# Altium project turret1.PrjPCB
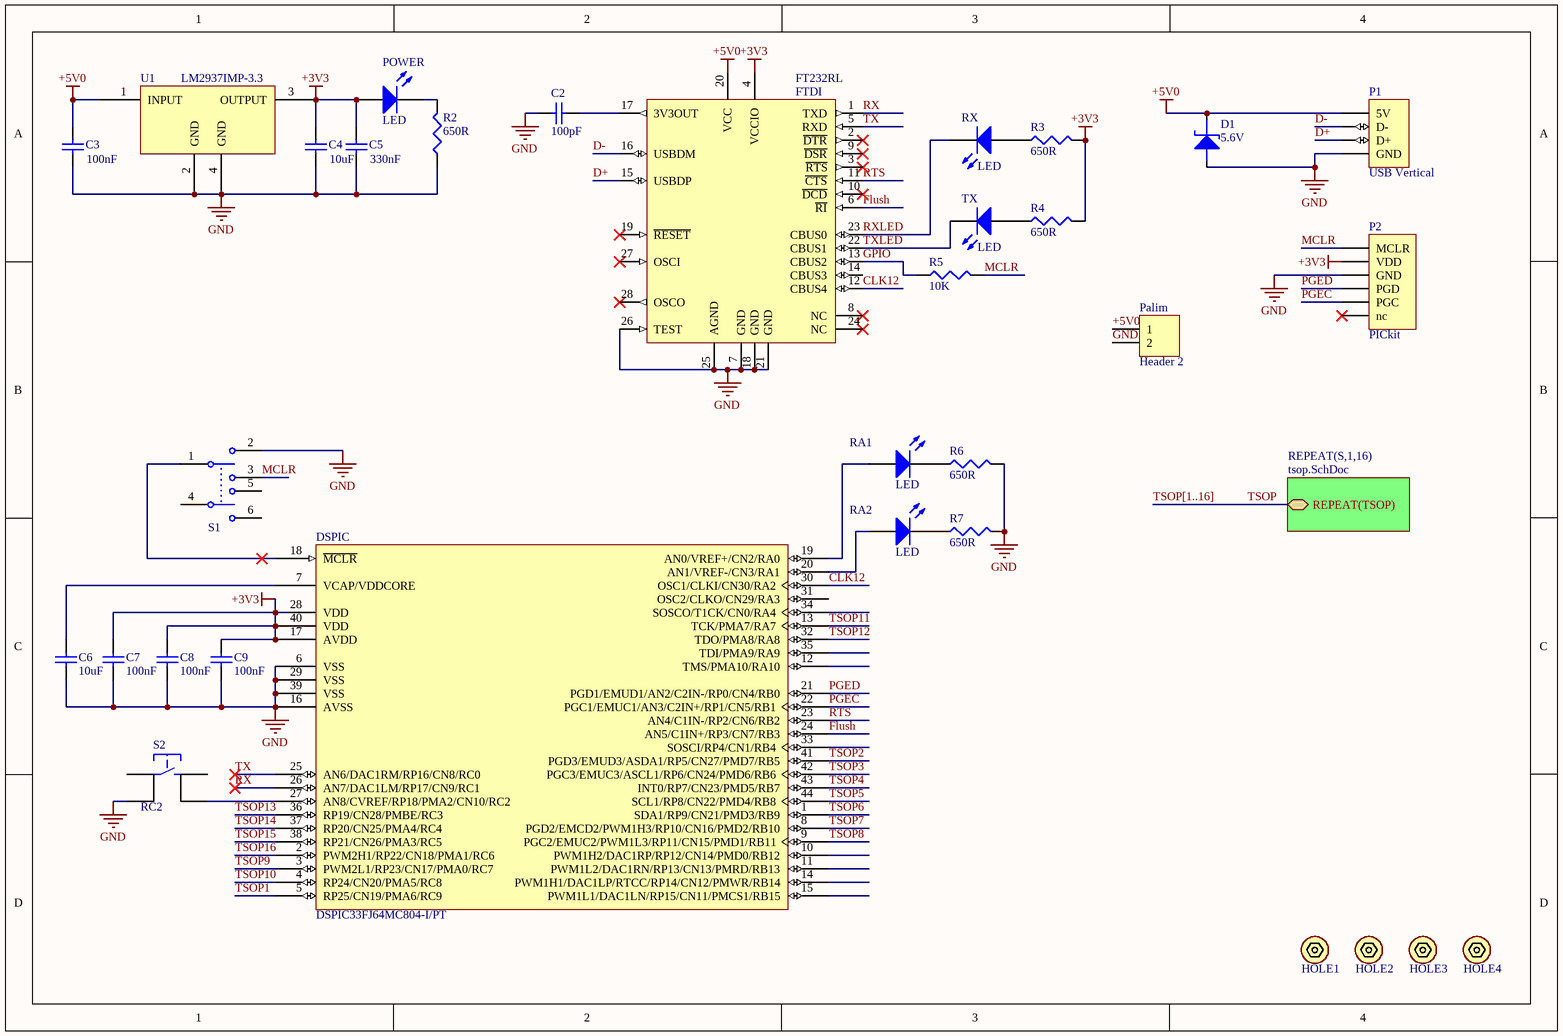
[diagram p0: turret1.SchDoc]
2 sheets, 80 parts. Net scope: hierarchical (ports join the sheet entries above them; power ports are global).
Board file: turret1.PcbDoc
Sheets:
  turret1.SchDoc
    S1 = tsop.SchDoc
    S2 = tsop.SchDoc
    S3 = tsop.SchDoc
    S4 = tsop.SchDoc
    S5 = tsop.SchDoc
    S6 = tsop.SchDoc
    S7 = tsop.SchDoc
    S8 = tsop.SchDoc
    S9 = tsop.SchDoc
    S10 = tsop.SchDoc
    S11 = tsop.SchDoc
    S12 = tsop.SchDoc
    S13 = tsop.SchDoc
    S14 = tsop.SchDoc
    S15 = tsop.SchDoc
    S16 = tsop.SchDoc

## Sheet turret1.SchDoc
size A4

### Parts
C2  value 100pF  [C0805C]  (hidden comment: CAP)
C3  value 100nF  [C0805C]
C4  value 10uF  [C0805C]
C5  value 330nF  [C0805C]
C6  value 10uF  [C0805C]  (hidden comment: CAP)
C7  value 100nF  [C0805C]  (hidden comment: CAP)
C8  value 100nF  [C0805C]  (hidden comment: CAP)
C9  value 100nF  [C0805C]  (hidden comment: CAP)
D1  5.6V  [DSO-C2/X1.8]
DSPIC  DSPIC33FJ64MC804-I/PT  [TQFP-PT44_N]
FTDI  FT232RL  [SSOP-28_M]
HOLE1  Hole  [SCREW]  (value not drawn)
HOLE2  Hole  [SCREW]  (value not drawn)
HOLE3  Hole  [SCREW]  (value not drawn)
HOLE4  Hole  [SCREW]  (value not drawn)
P1  USB Vertical  [USB type B Vert]
P2  PICkit  [HDR1X6H]
Palim  Header 2  [Bornier male coude 2 voies]
POWER  LED  [LED1206G]
R2  value 650R  [C0805R]
R3  value 650R  [C0805R]  (hidden comment: RES)
R4  value 650R  [C0805R]  (hidden comment: RES)
R5  value 10K  [C0805R]  (hidden comment: RES)
R6  value 650R  [C0805R]  (hidden comment: RES)
R7  value 650R  [C0805R]  (hidden comment: RES)
RA1  LED  [LED1206R]
RA2  LED  [LED1206R]
RX  LED  [LED1206Y]
S1  SW-DPDT/Reset  [MCLSS22]  (value not drawn)
S2  RC2  [SPST-NO]
TX  LED  [LED1206Y]
U1  LM2937IMP-3.3  [SOT-223]

### Sub-sheets
REPEAT(S,1,16) = tsop.SchDoc: REPEAT(TSOP) (bidir)

### Nets
+3V3: C4.1 C5.1 C7.2 C8.2 C9.2 DSPIC.17(AVDD) DSPIC.28(VDD) DSPIC.40(VDD) FTDI.4(VCCIO) P2.2(VDD) POWER.1(A) R3.2 R4.2 U1.3(OUTPUT)
+5V0: C3.1 D1.A FTDI.20(VCC) P1.1(5V) Palim.1 U1.1(INPUT)
GND: C2.2 C3.2 C4.2 C5.2 C6.1 C7.1 C8.1 C9.1 D1.K DSPIC.6(VSS) DSPIC.16(AVSS) DSPIC.29(VSS) DSPIC.39(VSS) FTDI.7(GND) FTDI.18(GND) FTDI.21(GND) FTDI.25(AGND) FTDI.26(TEST) P1.4(GND) P2.3(GND) Palim.2 R2.1 R6.2 R7.2 S1.2 S2.2 U1.2(GND) U1.4(GND)
CLK12: DSPIC.30(OSC1/CLKI/CN30/RA2) FTDI.12(CBUS4)
D+: FTDI.15(USBDP) P1.3(D+)
D-: FTDI.16(USBDM) P1.2(D-)
Flush: DSPIC.24(AN5/C1IN+/RP3/CN7/RB3) FTDI.6(~{RI})
GPIO: FTDI.13(CBUS2) R5.1
MCLR: P2.1(MCLR) R5.2 S1.3
PGEC: DSPIC.22(PGC1/EMUC1/AN3/C2IN+/RP1/CN5/RB1) P2.5(PGC)
PGED: DSPIC.21(PGD1/EMUD1/AN2/C2IN-/RP0/CN4/RB0) P2.4(PGD)
RTS: DSPIC.23(AN4/C1IN-/RP2/CN6/RB2) FTDI.11(~{CTS})
RX: DSPIC.26(AN7/DAC1LM/RP17/CN9/RC1) FTDI.1(TXD)
RXLED: FTDI.23(CBUS0) RX.2(K)
TSOP: sheet REPEAT(S,1,16)/REPEAT(TSOP)
TSOP1: DSPIC.5(RP25/CN19/PMA6/RC9)
TSOP2: DSPIC.41(PGD3/EMUD3/ASDA1/RP5/CN27/PMD7/RB5)
TSOP3: DSPIC.42(PGC3/EMUC3/ASCL1/RP6/CN24/PMD6/RB6)
TSOP4: DSPIC.43(INT0/RP7/CN23/PMD5/RB7)
TSOP5: DSPIC.44(SCL1/RP8/CN22/PMD4/RB8)
TSOP6: DSPIC.1(SDA1/RP9/CN21/PMD3/RB9)
TSOP7: DSPIC.8(PGD2/EMCD2/PWM1H3/RP10/CN16/PMD2/RB10)
TSOP8: DSPIC.9(PGC2/EMUC2/PWM1L3/RP11/CN15/PMD1/RB11)
TSOP9: DSPIC.3(PWM2L1/RP23/CN17/PMA0/RC7)
TSOP10: DSPIC.4(RP24/CN20/PMA5/RC8)
TSOP11: DSPIC.13(TCK/PMA7/RA7)
TSOP12: DSPIC.32(TDO/PMA8/RA8)
TSOP13: DSPIC.36(RP19/CN28/PMBE/RC3)
TSOP14: DSPIC.37(RP20/CN25/PMA4/RC4)
TSOP15: DSPIC.38(RP21/CN26/PMA3/RC5)
TSOP16: DSPIC.2(PWM2H1/RP22/CN18/PMA1/RC6)
TX: DSPIC.25(AN6/DAC1RM/RP16/CN8/RC0) FTDI.5(RXD)
TXLED: FTDI.22(CBUS1) TX.2(K)
NetC2_1: C2.1 FTDI.17(3V3OUT)
NetC6_2: C6.2 DSPIC.7(VCAP/VDDCORE)
NetDSPIC_18: DSPIC.18(~{MCLR}) S1.1
NetDSPIC_19: DSPIC.19(AN0/VREF+/CN2/RA0) RA1.1(A)
NetDSPIC_20: DSPIC.20(AN1/VREF-/CN3/RA1) RA2.1(A)
NetDSPIC_27: DSPIC.27(AN8/CVREF/RP18/PMA2/CN10/RC2) S2.3
NetPOWER_2: POWER.2(K) R2.2
NetR3_1: R3.1 RX.1(A)
NetR4_1: R4.1 TX.1(A)
NetR6_1: R6.1 RA1.2(K)
NetR7_1: R7.1 RA2.2(K)

Not connected (* = marked no-connect by the designer): DSPIC 10(PWM1H2/DAC1RP/RP12/CN14/PMD0/RB12) 11(PWM1L2/DAC1RN/RP13/CN13/PMRD/RB13) 12(TMS/PMA10/RA10) 14(PWM1H1/DAC1LP/RTCC/RP14/CN12/PMWR/RB14) 15(PWM1L1/DAC1LN/RP15/CN11/PMCS1/RB15) 31(OSC2/CLKO/CN29/RA3) 33(SOSCI/RP4/CN1/RB4) 34(SOSCO/T1CK/CN0/RA4) 35(TDI/PMA9/RA9); FTDI 2(~{DTR})* 3(~{RTS})* 8(NC)* 9(~{DSR})* 10(~{DCD})* 14(CBUS3) 19(~{RESET})* 24(NC)* 27(OSCI)* 28(OSCO)*; HOLE1 1(Hole); HOLE2 1(Hole); HOLE3 1(Hole); HOLE4 1(Hole); P2 6(nc)*; S1 4 5 6; S2 1 4

### Buses and harness runs
bus TSOP[1..16]

### Library data of the parts
C2 C6-C9 = CAP: Capacitor; Published: 8-Jun-2000; LatestRevisionDate: 29-May-2009; LatestRevisionNote: IPC-7351 Footprint Added.; PackageReference: C1206; Publisher: Altium Limited; PackageDescription: Chip Capacitor
C3-C5 = Cap Semi: Capacitor (Semiconductor SIM Model); Published: 8-Jun-2000; LatestRevisionDate: 29-May-2009; LatestRevisionNote: IPC-7351 Footprint Added.; PackageReference: C1206; Publisher: Altium Limited; PackageDescription: Chip Capacitor
D1 = Zener: Zener Diode
DSPIC = DSPIC33FJ64MC804-I/PT: High-Performance 16-bit Digital Signal Controller, 64 KB Flash, 16 KB RAM, 44-Pin TQFP, Industrial Temperature; Published: 2-Dec-2009; DatasheetVersion: revD, Nov-2009; PackageVersion: revBB, Aug-2009; PackageReference: TQFP-PT44; Publisher: Altium Limited; PackageDescription: 44-Lead Plastic Thin Quad Flatpack (PT) - 10x10x1mm Body, 2.00mm [TQFP]; Supplier 1: Digi-Key; Supplier Part Number 1: DSPIC33FJ64MC804-I/PT-ND; Supplier 2: Farnell; Supplier Part Number 2: 1576844; Code_JEDEC: MS-026; ComponentLink1Description: Datasheet; ComponentLink1URL: http://ww1.microchip.com/downloads/en/DeviceDoc/70291D.pdf; ComponentLink2Description: Packaging Specification; ComponentLink2URL: http://www.microchip.com/stellent/groups/techpub_sg/documents/packagingspec/en012702.pdf; ComponentLink3Description: Microchip.com Home; ComponentLink3URL: http://www.microchip.com/
FTDI = FT232RL: USB UART Asynchronous Serial Data Transfer Chip, SSOP-28, Tube; Published: 19-Aug-2010; DatasheetVersion: ver 2.07, Jul-2010; PackageVersion: 2010; PackageReference: SSOP-28; Publisher: Altium Limited; PackageDescription: 28-Pin Small Outline Package 0.65 mm Pitch; ComponentLink1Description: Manufacturer Link; ComponentLink1URL: http://www.ftdichip.com/Products/ICs/FT232R.htm; ComponentLink2Description: Datasheet; ComponentLink2URL: http://www.ftdichip.com/Support/Documents/DataSheets/ICs/DS_FT232R.pdf
HOLE1-HOLE4 = Hole: Mounting Hole for screws
P1 = USB Con: USB Connector; LatestRevisionDate: 17-Jul-2002; LatestRevisionNote: Re-released for DXP Platform.; Publisher: Altium Limited
P2 = Header ICSP: Header, 6-Pin, Right Angle; LatestRevisionDate: 17-Jul-2002; LatestRevisionNote: Re-released for DXP Platform.; Publisher: Altium Limited
Palim = Header 2: Header, 2-Pin; LatestRevisionDate: 17-Jul-2002; LatestRevisionNote: Re-released for DXP Platform.; Publisher: Altium Limited
POWER = LED: Typical LED; Published: 8-Jun-2000; LatestRevisionDate: 17-Jul-2002; LatestRevisionNote: Re-released for DXP Platform.; PackageVersion: Feb-2002; PackageReference: 3.2X1.6X1.1; Publisher: Altium Limited; PackageDescription: SM LED; 2 Flat Leads
R2 = Res3: Resistor; Published: 8-Jun-2000; LatestRevisionDate: 29-May-2009; LatestRevisionNote: IPC-7351 Footprint Added.; PackageReference: J1-0603; Publisher: Altium Limited; PackageDescription: Chip Resistor
R3-R7 = RES: Resistor; Published: 8-Jun-2000; LatestRevisionDate: 29-May-2009; LatestRevisionNote: IPC-7351 Footprint Added.; PackageReference: J1-0603; Publisher: Altium Limited; PackageDescription: Chip Resistor
RA1 RA2 RX TX = LED2: Typical RED, GREEN, YELLOW, AMBER GaAs LED; Published: 8-Jun-2000; LatestRevisionDate: 17-Jul-2002; LatestRevisionNote: Re-released for DXP Platform.; PackageVersion: Feb-2002; PackageReference: 3.2X1.6X1.1; Publisher: Altium Limited; PackageDescription: SM LED; 2 Flat Leads
S1 = SW-DPDT: Double-Pole, Double-Throw Switch, ref MCLSS22; Published: 24-Mar-1999; LatestRevisionDate: 17-Jul-2002; LatestRevisionNote: Re-released for DXP Platform.; PackageReference: DPDT-6; Publisher: Altium Limited; PackageDescription: Switch; 6 Leads
S2 = SPST-NO: Tactile Switch 7.3mm, SMD
U1 = LM2937IMP-3.3: 500 mA Low Dropout Regulator

## Sheet tsop.SchDoc
size A4
Used 16 times, as channels S1, S2, S3, S4, S5, S6, S7, S8, S9, S10, S11, S12, S13, S14, S15, S16. Parts and nets are listed once, with the designators drawn on the sheet.
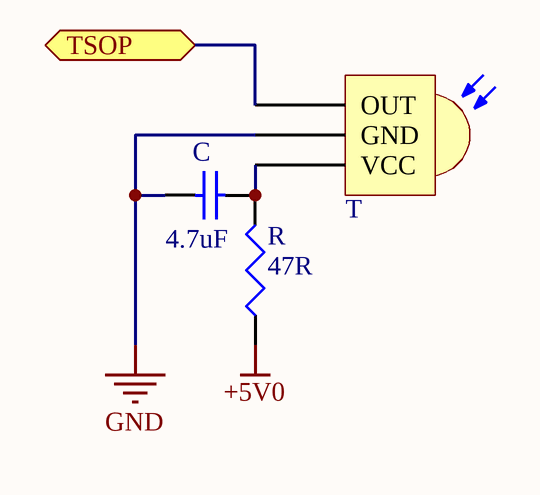
[diagram p1: tsop.SchDoc]

### Parts
C  value 4.7uF  [C0805C]  (hidden comment: CAP)
R  value 47R  [C0805R]  (hidden comment: RES)
T  TSOP7000  [TSOP IR]  (value not drawn)

### Ports
TSOP (bidir)

### Nets
+5V0: R.1
GND: C.2 T.2(GND)
TSOP: T.1(OUT) ; port TSOP
NetC_1: C.1 R.2 T.3(VCC)

### Channels
S1: designators end in _S1; ports TSOP=TSOP1
S2: designators end in _S2; ports TSOP=TSOP2
S3: designators end in _S3; ports TSOP=TSOP3
S4: designators end in _S4; ports TSOP=TSOP4
S5: designators end in _S5; ports TSOP=TSOP5
S6: designators end in _S6; ports TSOP=TSOP6
S7: designators end in _S7; ports TSOP=TSOP7
S8: designators end in _S8; ports TSOP=TSOP8
S9: designators end in _S9; ports TSOP=TSOP9
S10: designators end in _S10; ports TSOP=TSOP10
S11: designators end in _S11; ports TSOP=TSOP11
S12: designators end in _S12; ports TSOP=TSOP12
S13: designators end in _S13; ports TSOP=TSOP13
S14: designators end in _S14; ports TSOP=TSOP14
S15: designators end in _S15; ports TSOP=TSOP15
S16: designators end in _S16; ports TSOP=TSOP16

### Library data of the parts
C = CAP: Capacitor; Published: 8-Jun-2000; LatestRevisionDate: 29-May-2009; LatestRevisionNote: IPC-7351 Footprint Added.; PackageReference: C1206; Publisher: Altium Limited; PackageDescription: Chip Capacitor
R = RES: Resistor; Published: 8-Jun-2000; LatestRevisionDate: 29-May-2009; LatestRevisionNote: IPC-7351 Footprint Added.; PackageReference: J1-0603; Publisher: Altium Limited; PackageDescription: Chip Resistor
T = TSOP7000: Vishay 455kHz IR Receiver

## Nets that join several sheets
+5V0: turret1 (6 pins), S1 (R_S1.1), S2 (R_S2.1), S3 (R_S3.1), S4 (R_S4.1), S5 (R_S5.1), S6 (R_S6.1), S7 (R_S7.1), S8 (R_S8.1), S9 (R_S9.1), S10 (R_S10.1), S11 (R_S11.1), S12 (R_S12.1), S13 (R_S13.1), S14 (R_S14.1), S15 (R_S15.1), S16 (R_S16.1)
GND: turret1 (28 pins), S1 (C_S1.2 T_S1.2), S2 (C_S2.2 T_S2.2), S3 (C_S3.2 T_S3.2), S4 (C_S4.2 T_S4.2), S5 (C_S5.2 T_S5.2), S6 (C_S6.2 T_S6.2), S7 (C_S7.2 T_S7.2), S8 (C_S8.2 T_S8.2), S9 (C_S9.2 T_S9.2), S10 (C_S10.2 T_S10.2), S11 (C_S11.2 T_S11.2), S12 (C_S12.2 T_S12.2), S13 (C_S13.2 T_S13.2), S14 (C_S14.2 T_S14.2), S15 (C_S15.2 T_S15.2), S16 (C_S16.2 T_S16.2)
TSOP1: turret1 (DSPIC.5), S1 (T_S1.1)
TSOP2: turret1 (DSPIC.41), S2 (T_S2.1)
TSOP3: turret1 (DSPIC.42), S3 (T_S3.1)
TSOP4: turret1 (DSPIC.43), S4 (T_S4.1)
TSOP5: turret1 (DSPIC.44), S5 (T_S5.1)
TSOP6: turret1 (DSPIC.1), S6 (T_S6.1)
TSOP7: turret1 (DSPIC.8), S7 (T_S7.1)
TSOP8: turret1 (DSPIC.9), S8 (T_S8.1)
TSOP9: turret1 (DSPIC.3), S9 (T_S9.1)
TSOP10: turret1 (DSPIC.4), S10 (T_S10.1)
TSOP11: turret1 (DSPIC.13), S11 (T_S11.1)
TSOP12: turret1 (DSPIC.32), S12 (T_S12.1)
TSOP13: turret1 (DSPIC.36), S13 (T_S13.1)
TSOP14: turret1 (DSPIC.37), S14 (T_S14.1)
TSOP15: turret1 (DSPIC.38), S15 (T_S15.1)
TSOP16: turret1 (DSPIC.2), S16 (T_S16.1)